# EAGLE design ruido (EAGLE 4.11)
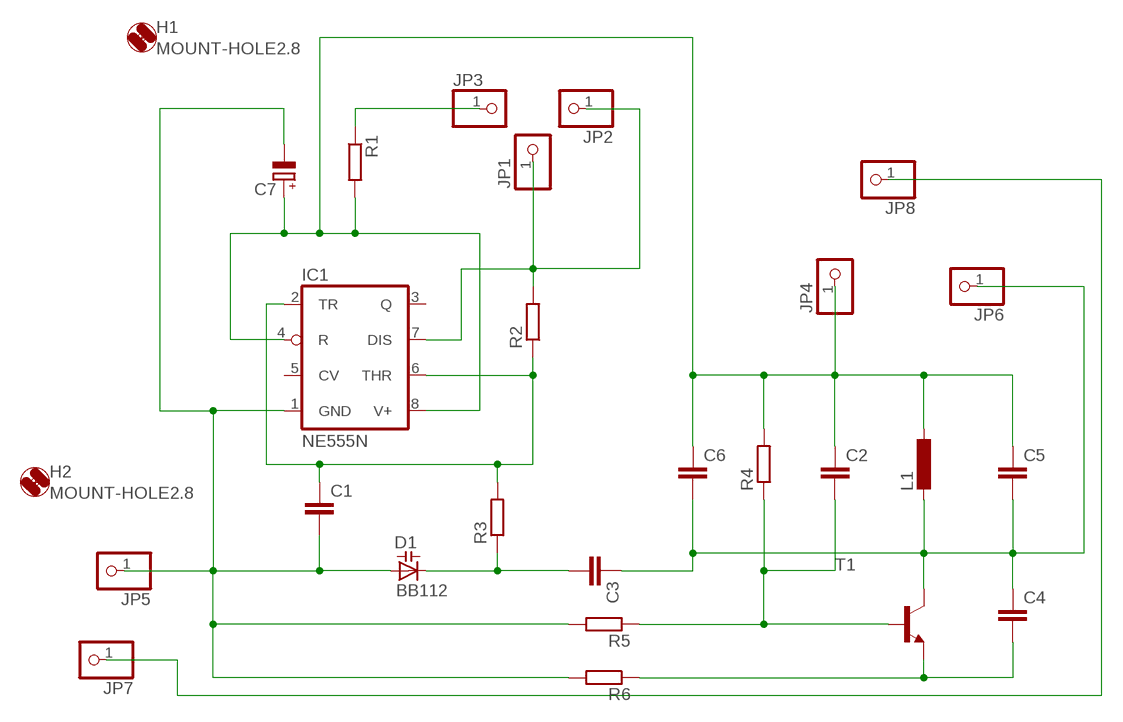
[diagram p0: schematic, sheet 1]

## Parts
C1  C-EU050-030X075  [C050-030X075]
C2  C-EU050-030X075  [C050-030X075]
C3  C-EU050-030X075  [C050-030X075]
C4  C-EU050-030X075  [C050-030X075]
C5  C-EU050-030X075  [C050-030X075]
C6  C-EU050-030X075  [C050-030X075]
C7  CPOL-EUE5-5  [E5-5]
D1  BB112  [SOT54H]
H1  MOUNT-HOLE2.8  [2,8]
H2  MOUNT-HOLE2.8  [2,8]
IC1  NE555N  [DIL08]
JP1  PINHD-1X1  [1X01]
JP2  PINHD-1X1  [1X01]
JP3  PINHD-1X1  [1X01]
JP4  PINHD-1X1  [1X01]
JP5  PINHD-1X1  [1X01]
JP6  PINHD-1X1  [1X01]
JP7  PINHD-1X1  [1X01]
JP8  PINHD-1X1  [1X01]
L1  L-EU0207/10  [0207/10]
R1  R-EU_0207/5V  [0207/5V]
R2  R-EU_0207/5V  [0207/5V]
R3  R-EU_0207/5V  [0207/5V]
R4  R-EU_0207/5V  [0207/5V]
R5  R-EU_0207/5V  [0207/5V]
R6  R-EU_0207/5V  [0207/5V]
T1  BF493S-NPN-TO92-CBE  [TO92-CBE]

## Nets
N$1: C2.1 C5.1 C6.1 C7.+ IC1.4(R) IC1.8(V+) JP4.1 L1.1 R1.2 R4.2
N$2: C1.1 IC1.2(TR) IC1.6(THR) R2.1 R3.2
N$3: IC1.7(DIS) JP1.1 JP2.1 R2.2
N$4: C3.1 C4.1 C5.2 C6.2 JP6.1 L1.2 T1.C
N$5: C1.2 C7.- D1.A IC1.1(GND) JP5.1 R5.2 R6.2
N$6: C3.2 D1.C R3.1
N$7: JP3.1 R1.1
N$8: C4.2 R6.1 T1.E
N$10: C2.2 R4.1 R5.1 T1.B
N$12: JP7.1 JP8.1
Unconnected: IC1.3(Q) IC1.5(CV)

## Library data of the parts
C1-C6 = rcl:C-EU: CAPACITOR, European symbol
C7 = rcl:CPOL-EU: POLARIZED CAPACITOR, European symbol
D1 = diode:BB112: Capacity DIODE variable-capacitance diode
H1 H2 = holes:MOUNT-HOLE: MOUNTING HOLE with drill center marker
IC1 = linear:*555: TIMER
JP1-JP8 = pinhead:PINHD-1X1: PIN HEADER
L1 = rcl:L-EU: INDUCTOR, European symbol
R1-R6 = rcl:R-EU_: RESISTOR, European symbol
T1 = transistor:*-NPN-: NPN Transistror

## Board
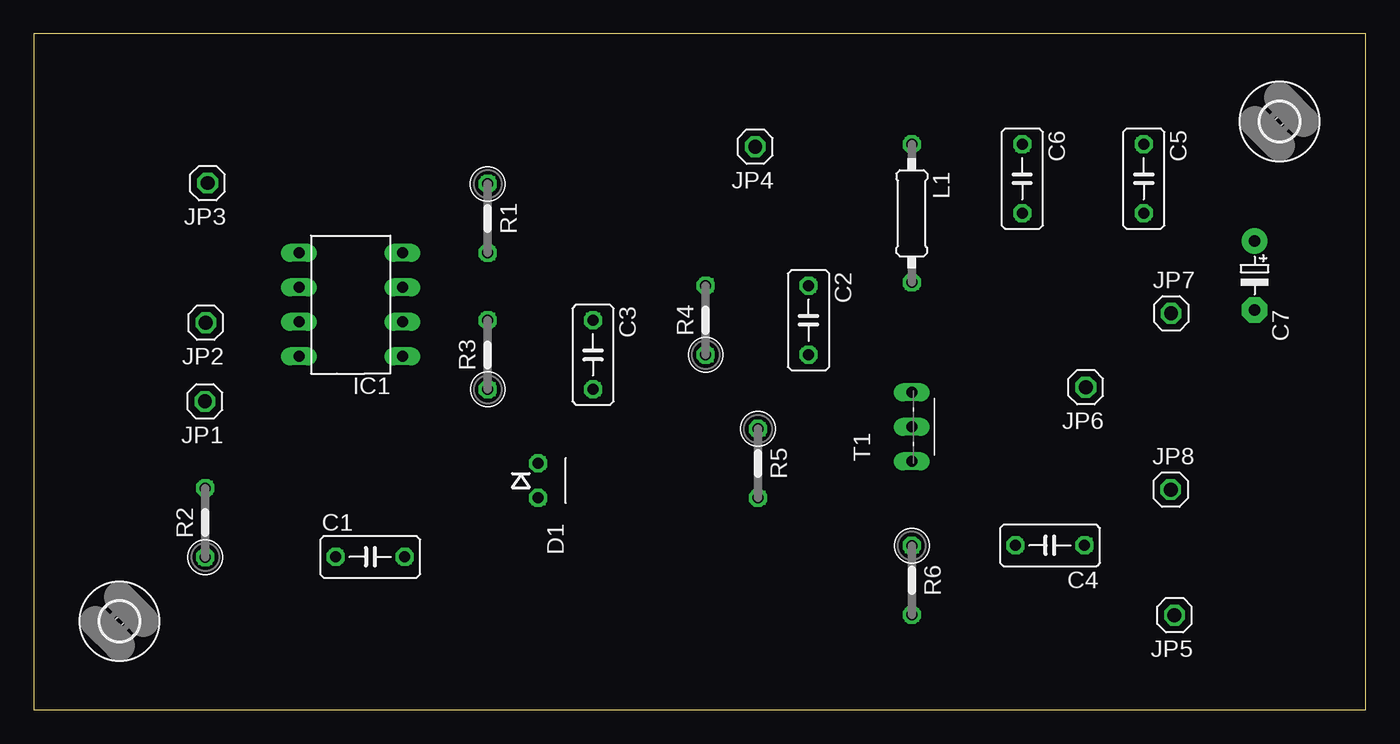
[diagram p1: board, top side]
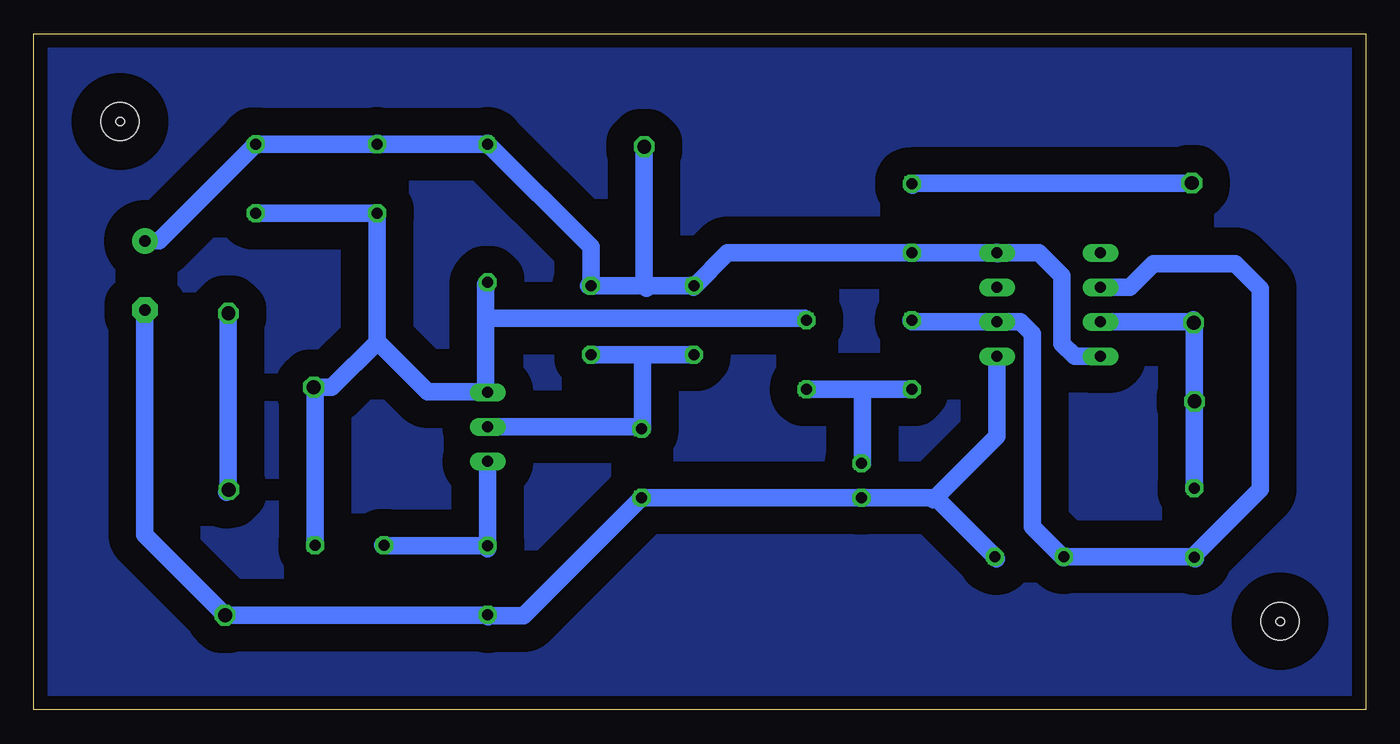
[diagram p2: board, bottom side, seen from below]

Size 98.06 x 49.74 mm. Coordinates in mm from the lower left corner, seen from the top.
Outline: 0,0 98.06,0 98.06,49.74 0,49.74 0,0
Copper layers 16: Bottom 0.035mm
Design rules "default": minimum track width 10mil, minimum drill 24mil, track to track 80mil, track to pad 80mil, pad to pad 80mil, via to via 80mil, smd to smd 80mil, copper to edge 40mil, drill to drill 8mil, minimum pad ring 10mil, minimum via ring 8mil, stop-mask expansion 4mil, vias tented up to drill 0mil, thermal gap 10mil
Holes 0.61 mm at 91.71,43.28 6.28,6.49

### Footprints (pad centres in the part's own frame; a part is rotated, then mirrored left to right if it is on the bottom)
C050-030X075 = drill 0.813 octagon: 1 -2.54,0; 2 2.54,0
E5-5 = drill 0.813 pad 1.905 round: + -2.54,0 | drill 0.813 pad 1.905 octagon: - 2.54,0
SOT54H = drill 0.813 octagon: A 1.27,0; C -1.27,0
2,8 = hole 2.8: 0,0
DIL08 = drill 0.813 long: 1 -3.81,-3.81; 2 -1.27,-3.81; 3 1.27,-3.81; 4 3.81,-3.81; 5 3.81,3.81; 6 1.27,3.81; 7 -1.27,3.81; 8 -3.81,3.81
1X01 = drill 1.016 octagon: 1 0,0
0207/10 = drill 0.813 octagon: 1 -5.08,0; 2 5.08,0
0207/5V = drill 0.813 octagon: 1 -2.54,0; 2 2.54,0
TO92-CBE = drill 0.813 long: B 0,0; C 2.54,0; E -2.54,0

### Placement (x,y rotation side)
C1  24.76,11.25 0 top
C2  57.04,28.67 270 top
C3  41.17,26.12 270 top
C4  74.83,12.09 180 top
C5  81.73,39.08 270 top
C6  72.77,39.08 270 top
C7  89.89,31.96 270 top
D1  37.12,16.86 270 top
H1  91.71,43.29 0 top
H2  6.3,6.51 0 top
IC1  23.33,29.82 90 top
JP1  12.59,22.69 180 top
JP2  12.65,28.49 180 top
JP3  12.79,38.77 180 top
JP4  53.12,41.44 180 top
JP5  83.99,6.95 180 top
JP6  77.46,23.73 180 top
JP7  83.74,29.17 0 top
JP8  83.71,16.2 0 top
L1  64.65,36.54 270 top
R1  33.42,36.16 270 top
R2  12.62,13.77 90 top
R3  33.42,26.11 90 top
R4  49.47,28.66 90 top
R5  53.31,18.13 270 top
R6  64.65,9.53 270 top
T1  64.64,20.82 90 top

### Tracks (layer width: path | path; a pad name or v marks a point on that pad's centre or on a via)
N$1
  Bottom 1.27: 64.65,41.66 64.67,41.68 | 64.65,41.66 L1.1 64.61,41.62 | 64.65,41.66 57.04,34.06 C2.1 57.2,31.21 | IC1.8 21.42,26.01 22.36,26.94 22.36,31.93 24.04,33.62 27.05,33.62 27.11,33.56 27.14,33.58 IC1.4 27.14,33.64 27.17,33.68 27.24,33.62 R1.2 46.98,33.62 49.47,31.13 | 49.47,31.13 49.5,31.09 | 49.47,31.13 R4.2 52.96,31.2 | 57.2,31.21 57.21,31.21 | 52.96,31.2 57.19,31.2 57.2,31.21 | 64.61,41.62 C6.1 72.77,41.66 72.79,41.68 72.85,41.62 C5.1 88.83,34.52 89.91,34.52 | 64.61,41.62 | 52.96,31.2 52.96,31.03 53.12,31.19 JP4.1 | 89.91,34.52 90.02,34.52 | 89.91,34.52 C7.+
N$2
  Bottom 1.27: R3.2 33.47,28.65 33.49,28.63 33.41,28.55 IC1.2 25.41,28.55 24.52,27.66 24.52,13.47 22.24,11.18 22.22,11.2 C1.1 12.73,11.25 | 12.62,11.19 12.55,11.12 | R2.1 12.62,11.19 | 12.73,11.25 12.68,11.25 12.62,11.19 | IC1.6 17.37,31.09 15.62,32.84 9.6,32.84 7.73,30.97 7.73,16.23 12.73,11.24 12.73,11.25
N$3
  Bottom 1.27: 12.61,28.49 12.61,28.33 | 12.61,28.49 JP2.1 12.65,28.67 | IC1.7 12.61,28.55 12.61,28.49 | R2.2 12.62,22.72 12.61,22.73 12.6,22.72 JP1.1 12.6,28.61 12.65,28.67 | 12.65,28.67 12.67,28.69
N$4
  Bottom 1.27: 64.79,23.39 64.68,23.39 T1.C | L1.2 64.79,31.31 64.79,28.81 | 64.79,28.81 64.79,23.39 | C3.1 41.32,28.81 64.79,28.81 | 64.79,23.39 69.06,23.39 72.76,27.09 | 72.76,27.09 72.79,27.12 72.79,36.51 | 72.83,36.54 72.85,36.57 | 72.83,36.54 C6.2 72.77,36.53 72.79,36.51 | 72.79,36.51 72.83,36.54 | C5.2 72.83,36.54 72.79,36.51 | 72.76,27.09 76.12,23.73 JP6.1 77.51,23.73 77.55,23.69 77.37,23.51 C4.1
N$5
  Bottom 1.27: 27.11,26.01 IC1.1 27.14,20.12 31.81,15.45 31.81,15.59 | R6.2 64.67,6.96 64.67,6.91 64.63,6.91 | 64.63,6.91 61.99,6.91 R5.2 53.29,15.57 53.28,15.59 D1.A 31.81,15.59 | C1.2 27.17,11.12 | C1.2 | 31.81,15.59 31.64,15.59 C1.2 | 64.63,6.91 64.63,6.84 64.74,6.95 JP5.1 89.9,12.86 | 89.9,12.86 | 89.9,12.86 89.9,29.41 C7.-
N$6
  Bottom 1.27: 41.2,23.57 41.2,23.58 C3.2 | 37.04,23.57 R3.1 | 37.04,23.57 41.2,23.57 | 41.2,23.57 | D1.C 37.04,18.13 37.04,23.57
N$7
  Bottom 1.27: R1.1 33.42,38.67 33.35,38.61 33.19,38.77 JP3.1
N$8
  Bottom 1.27: 64.65,11.86 64.67,11.84 | 64.65,11.86 R6.1 72.36,12.07 72.37,12.08 72.36,12.09 C4.2 | T1.E 64.64,11.87 64.65,11.86
N$9  (via drill 0.61)
  other vias: 12.77,38.7
N$10
  Bottom 1.27: 57.09,26.12 57.09,26.13 C2.2 | 53.23,26.12 R4.1 | 53.23,26.12 57.09,26.12 | 57.09,26.12 57.09,26.1 | R5.1 53.23,20.66 53.23,20.74 | 53.23,20.74 53.23,26.12 | 53.23,20.74 53.29,20.74 53.29,20.82 T1.B
N$11  (via drill 0.61)
  other vias: 33.44,38.76
N$12
  Bottom 1.27: 83.74,16.13 83.71,16.16 JP8.1 | 83.74,16.13 JP7.1 | 83.74,16.13 83.88,15.99
N$13  (via drill 0.61)
  other vias: 33.44,33.59
N$14  (via drill 0.61)
  other vias: 27.15,33.64
N$15  (via drill 0.61)
  other vias: 27.15,31.14
N$16  (via drill 0.61)
  other vias: 27.15,28.53
N$17  (via drill 0.61)
  other vias: 27.15,26.03
N$18  (via drill 0.61)
  other vias: 19.54,26.03
N$19  (via drill 0.61)
  other vias: 19.48,28.53
N$20  (via drill 0.61)
  other vias: 19.54,31.09
N$21  (via drill 0.61)
  other vias: 19.54,33.59
N$22  (via drill 0.61)
  other vias: 12.67,28.48
N$23  (via drill 0.61)
  other vias: 12.61,22.67
N$24  (via drill 0.61)
  other vias: 12.67,16.34
N$25  (via drill 0.61)
  other vias: 12.61,11.17
N$26  (via drill 0.61)
  other vias: 22.25,11.28
N$27  (via drill 0.61)
  other vias: 27.31,11.23
N$28  (via drill 0.61)
  other vias: 33.49,23.58
N$29  (via drill 0.61)
  other vias: 33.44,28.69
N$30  (via drill 0.61)
  other vias: 41.16,28.69
N$31  (via drill 0.61)
  other vias: 41.22,23.58
N$32  (via drill 0.61)
  other vias: 37.17,18.15
N$33  (via drill 0.61)
  other vias: 37.17,15.54
N$34  (via drill 0.61)
  other vias: 49.52,26.08
N$35  (via drill 0.61)
  other vias: 49.52,31.25
N$36  (via drill 0.61)
  other vias: 53.15,41.42
N$37  (via drill 0.61)
  other vias: 57.09,31.19
N$38  (via drill 0.61)
  other vias: 57.03,26.14
N$39  (via drill 0.61)
  other vias: 53.36,20.65
N$40  (via drill 0.61)
  other vias: 53.36,15.59
N$41  (via drill 0.61)
  other vias: 64.7,23.31
N$42  (via drill 0.61)
  other vias: 64.6,20.86
N$43  (via drill 0.61)
  other vias: 64.7,18.31
N$44  (via drill 0.61)
  other vias: 64.65,31.41
N$45  (via drill 0.61)
  other vias: 64.65,41.63
N$46  (via drill 0.61)
  other vias: 72.8,41.58
N$47  (via drill 0.61)
  other vias: 72.8,36.52
N$48  (via drill 0.61)
  other vias: 81.75,36.52
N$49  (via drill 0.61)
  other vias: 81.69,41.63
N$50  (via drill 0.61)
  other vias: 83.72,29.17
N$51  (via drill 0.61)
  other vias: 83.72,16.18
N$52  (via drill 0.61)
  other vias: 77.43,23.69
N$53  (via drill 0.61)
  other vias: 64.65,12.02
N$54  (via drill 0.61)
  other vias: 64.65,6.97
N$55  (via drill 0.61)
  other vias: 77.43,12.13
N$56  (via drill 0.61)
  other vias: 72.32,12.08
N$57  (via drill 0.61)
  other vias: 84.04,6.97
N$58  (via drill 0.61)
  other vias: 89.9,34.5
N$59  (via drill 0.61)
  other vias: 89.95,29.44
N$60
  pour Bottom: 0.63,0.47 97.2,0.47 97.2,49.02 0.63,49.02